# Altium schematic sheet Power-Tree-VBATT-Filter.SchDoc
size A4; DocumentNumber: 3-; SheetNumber: 3; SheetTotal: 7
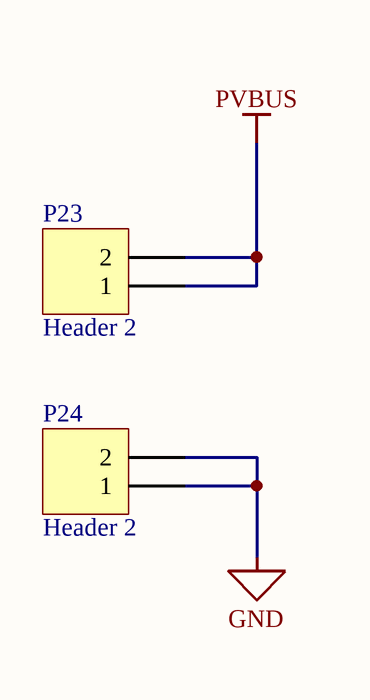
[diagram p0: Power-Tree-VBATT-Filter.SchDoc]

## Parts
P23  Header 2  [HDR1X2]
P24  Header 2  [HDR1X2]

## Nets
GND: P24.1 P24.2
PVBUS: P23.1 P23.2

## Notes on the sheet
- Title
- Size:
- Date:
- Engineer
- A4
- Number:
- Sheet
- of
- Approved
- Revision:
- UC Riverside
- www.highlanderracing.org <https://www.highlanderracing.org>
- File:

## Library data of the parts
P23 P24 = Header 2: Header, 2-Pin; LatestRevisionDate: 17-Jul-2002; LatestRevisionNote: Re-released for DXP Platform.; Publisher: Altium Limited